# EAGLE schematic thermister-led (EAGLE 8.1.0)
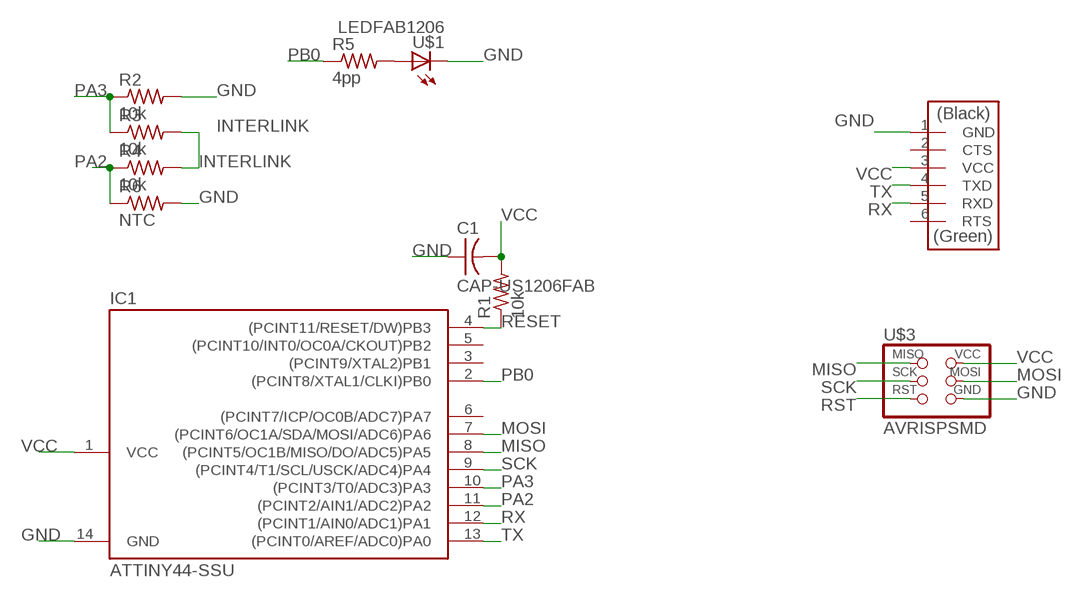
[diagram p0: schematic, sheet 1]

## Parts
C1  CAP-US1206FAB  [C1206FAB]
IC1  ATTINY44-SSU  [SOIC14]
R1  10k  RES-US1206FAB  [R1206FAB]
R2  10k  RES-US1206FAB  [R1206FAB]
R3  10k  RES-US1206FAB  [R1206FAB]
R4  10k  RES-US1206FAB  [R1206FAB]
R5  4pp  RES-US1206FAB  [R1206FAB]
R6  NTC  RES-US1206FAB  [R1206FAB]
U$1  LEDFAB1206  [LED1206FAB]
U$2  FTDI-SMD-HEADER  [1X06SMD]
U$3  AVRISPSMD  [2X03SMD]

## Nets
GND: C1.1 IC1.14(GND) R2.2 R6.2 U$1.2(C) U$2.1(GND) U$3.6(GND)
INTERLINK: R3.2 R4.2
MISO: IC1.8((PCINT5/OC1B/MISO/DO/ADC5)PA5) U$3.1(MISO)
MOSI: IC1.7((PCINT6/OC1A/SDA/MOSI/ADC6)PA6) U$3.4(MOSI)
N$1: R5.2 U$1.1(A)
PA2: IC1.11((PCINT2/AIN1/ADC2)PA2) R4.1 R6.1
PA3: IC1.10((PCINT3/T0/ADC3)PA3) R2.1 R3.1
PB0: IC1.2((PCINT8/XTAL1/CLKI)PB0) R5.1
RESET: IC1.4((PCINT11/RESET/DW)PB3) R1.1
RST: U$3.5(RST)
RX: IC1.12((PCINT1/AIN0/ADC1)PA1) U$2.5(RXD)
SCK: IC1.9((PCINT4/T1/SCL/USCK/ADC4)PA4) U$3.3(SCK)
TX: IC1.13((PCINT0/AREF/ADC0)PA0) U$2.4(TXD)
VCC: C1.2 IC1.1(VCC) R1.2 U$2.3(VCC) U$3.2(VCC)
Unconnected: IC1.3((PCINT9/XTAL2)PB1) IC1.5((PCINT10/INT0/OC0A/CKOUT)PB2) IC1.6((PCINT7/ICP/OC0B/ADC7)PA7) U$2.2(CTS) U$2.6(RTS)

## Library data of the parts
C1 = fab:CAP-US
IC1 = fab:ATTINY44
R1-R6 = fab:RES-US: Resistor (US Symbol) Variants with postfix FAB are widened to allow the routing of internal traces
U$1 = fab:LED: LED
U$2 = fab:FTDI-SMD-HEADER
U$3 = fab:AVRISP

## Net classes
0 default: width 0.03 mm, clearance 0.315 mm